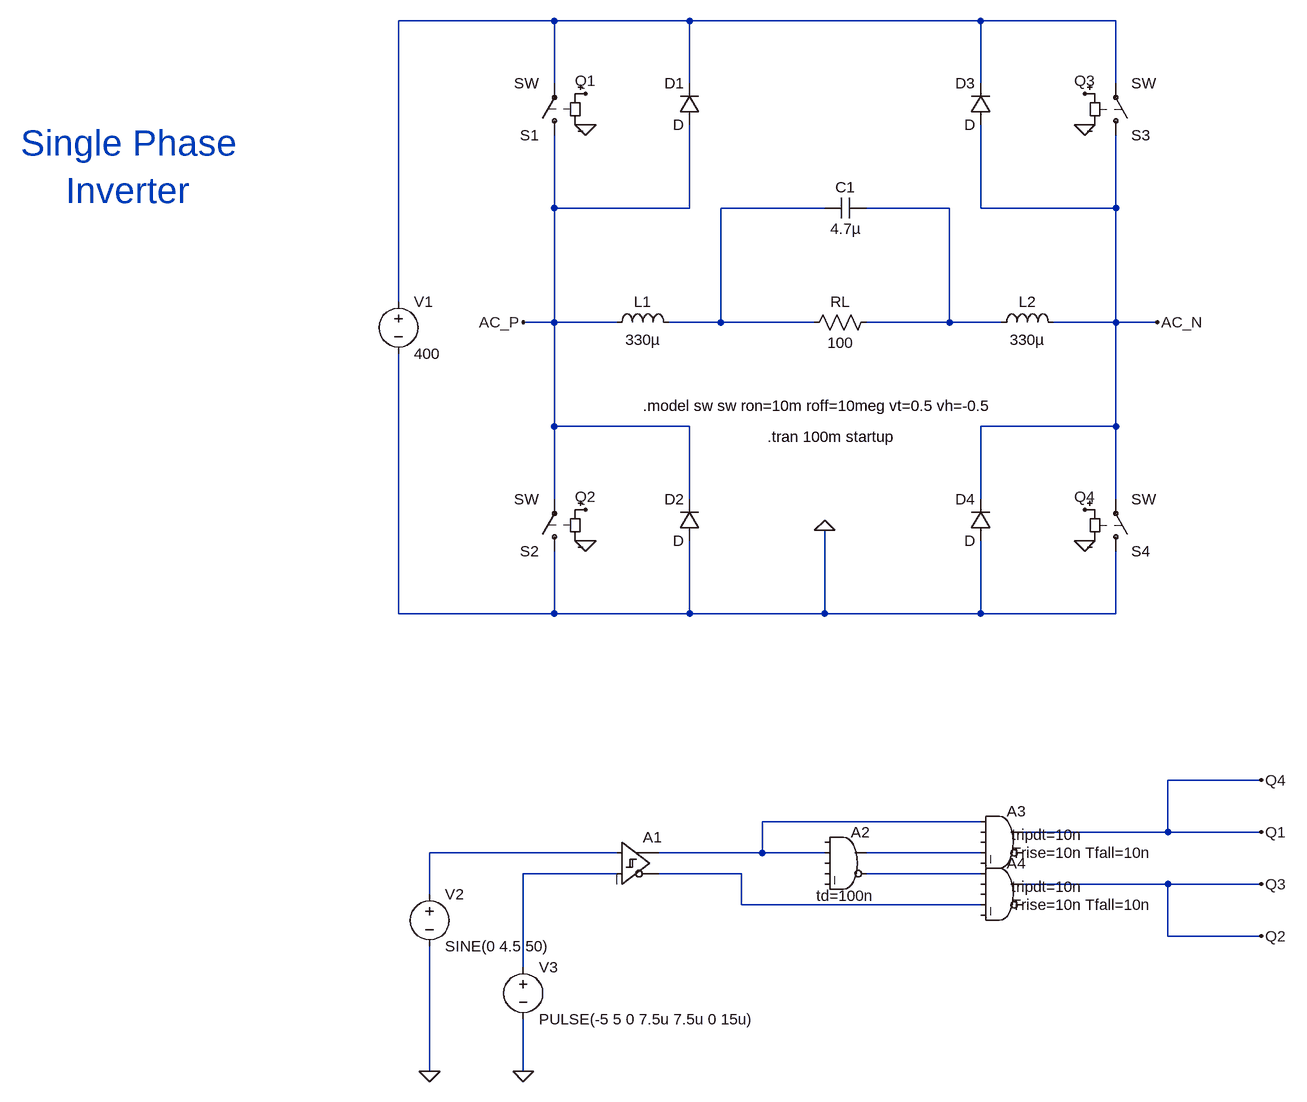
[diagram p0: schematic Ideal_Switches.asc]
Ideal_Switches.asc, the LTspice schematic file:
Version 4.1
SHEET 1 1104 1268
WIRE -32 -368 -272 -368
WIRE 176 -368 -32 -368
WIRE 624 -368 176 -368
WIRE 832 -368 624 -368
WIRE -32 -272 -32 -368
WIRE 176 -272 176 -368
WIRE 624 -272 624 -368
WIRE 832 -272 832 -368
WIRE -32 -80 -32 -192
WIRE 176 -80 176 -208
WIRE 176 -80 -32 -80
WIRE 384 -80 224 -80
WIRE 576 -80 448 -80
WIRE 624 -80 624 -208
WIRE 832 -80 832 -192
WIRE 832 -80 624 -80
WIRE -272 64 -272 -368
WIRE -32 96 -32 -80
WIRE -32 96 -80 96
WIRE 64 96 -32 96
WIRE 224 96 224 -80
WIRE 224 96 144 96
WIRE 368 96 224 96
WIRE 576 96 576 -80
WIRE 576 96 448 96
WIRE 656 96 576 96
WIRE 832 96 832 -80
WIRE 832 96 736 96
WIRE 896 96 832 96
WIRE -32 256 -32 96
WIRE 176 256 -32 256
WIRE 832 256 832 96
WIRE 832 256 624 256
WIRE -32 368 -32 256
WIRE 176 368 176 256
WIRE 624 368 624 256
WIRE 832 368 832 256
WIRE -272 544 -272 144
WIRE -32 544 -32 448
WIRE -32 544 -272 544
WIRE 176 544 176 432
WIRE 176 544 -32 544
WIRE 384 544 384 416
WIRE 384 544 176 544
WIRE 624 544 624 432
WIRE 624 544 384 544
WIRE 832 544 832 448
WIRE 832 544 624 544
WIRE 1056 800 912 800
WIRE 624 864 288 864
WIRE 912 880 912 800
WIRE 912 880 688 880
WIRE 1056 880 912 880
WIRE 64 912 -224 912
WIRE 288 912 288 864
WIRE 288 912 128 912
WIRE 384 912 288 912
WIRE 624 912 448 912
WIRE 64 944 -80 944
WIRE 256 944 128 944
WIRE 624 944 448 944
WIRE 912 960 688 960
WIRE 1056 960 912 960
WIRE -224 976 -224 912
WIRE 256 992 256 944
WIRE 624 992 256 992
WIRE 912 1040 912 960
WIRE 1056 1040 912 1040
WIRE -80 1088 -80 944
WIRE -224 1248 -224 1056
WIRE -80 1248 -80 1168
FLAG 16 -208 0
FLAG 16 432 0
FLAG 784 432 0
FLAG 784 -208 0
FLAG -80 1248 0
FLAG -224 1248 0
FLAG 1056 880 Q1
FLAG 1056 800 Q4
FLAG 1056 960 Q3
FLAG 1056 1040 Q2
FLAG 16 -256 Q1
FLAG 16 384 Q2
FLAG 784 -256 Q3
FLAG 784 384 Q4
FLAG -80 96 AC_P
FLAG 896 96 AC_N
FLAG 384 416 0
SYMBOL voltage -272 48 R0
WINDOW 123 0 0 Left 0
WINDOW 39 0 0 Left 0
SYMATTR InstName V1
SYMATTR Value 400
SYMBOL sw -32 -176 R180
SYMATTR InstName S1
SYMBOL sw -32 464 R180
SYMATTR InstName S2
SYMBOL sw 832 464 M180
SYMATTR InstName S4
SYMBOL sw 832 -176 M180
SYMATTR InstName S3
SYMBOL diode 192 -208 R180
WINDOW 0 24 64 Left 2
WINDOW 3 24 0 Left 2
SYMATTR InstName D1
SYMBOL diode 640 -208 R180
WINDOW 0 24 64 Left 2
WINDOW 3 24 0 Left 2
SYMATTR InstName D3
SYMBOL diode 640 432 R180
WINDOW 0 24 64 Left 2
WINDOW 3 24 0 Left 2
SYMATTR InstName D4
SYMBOL diode 192 432 R180
WINDOW 0 24 64 Left 2
WINDOW 3 24 0 Left 2
SYMATTR InstName D2
SYMBOL res 464 80 R90
WINDOW 0 0 56 VBottom 2
WINDOW 3 32 56 VTop 2
SYMATTR InstName RL
SYMATTR Value 100
SYMBOL ind 48 112 R270
WINDOW 0 32 56 VTop 2
WINDOW 3 5 56 VBottom 2
SYMATTR InstName L1
SYMATTR Value 330µ
SYMATTR SpiceLine Rser=0.1
SYMBOL ind 640 112 R270
WINDOW 0 32 56 VTop 2
WINDOW 3 5 56 VBottom 2
SYMATTR InstName L2
SYMATTR Value 330µ
SYMATTR SpiceLine Rser=0.1
SYMBOL cap 448 -96 R90
WINDOW 0 0 32 VBottom 2
WINDOW 3 32 32 VTop 2
SYMATTR InstName C1
SYMATTR Value 4.7µ
SYMATTR SpiceLine Rser=0.1
SYMBOL voltage -224 960 R0
WINDOW 123 0 0 Left 0
WINDOW 39 0 0 Left 0
SYMATTR InstName V2
SYMATTR Value SINE(0 4.5 50)
SYMBOL voltage -80 1072 R0
WINDOW 123 0 0 Left 0
WINDOW 39 0 0 Left 0
SYMATTR InstName V3
SYMATTR Value PULSE(-5 5 0 7.5u 7.5u 0 15u)
SYMBOL Digital\\diffschmitt 64 864 R0
SYMATTR InstName A1
SYMBOL Digital\\and 416 864 R0
WINDOW 3 -45 114 Left 2
SYMATTR Value td=100n
SYMATTR InstName A2
SYMBOL Digital\\and 656 832 R0
WINDOW 3 16 52 Left 2
WINDOW 123 16 80 Left 2
SYMATTR Value tripdt=10n
SYMATTR Value2 Trise=10n Tfall=10n
SYMATTR InstName A3
SYMBOL Digital\\and 656 912 R0
WINDOW 3 16 52 Left 2
WINDOW 123 16 80 Left 2
SYMATTR Value tripdt=10n
SYMATTR Value2 Trise=10n Tfall=10n
SYMATTR InstName A4
TEXT 104 224 Left 2 !.model sw sw ron=10m roff=10meg vt=0.5 vh=-0.5
TEXT 296 272 Left 2 !.tran 100m startup
TEXT -688 -144 Center 5 ;Single Phase\nInverter

The netlist it stands for:
* Ideal_Switches.asc
V1 N001 0 400
S1 AC_P N001 Q4 0 SW
S2 0 AC_P Q2 0 SW
S4 0 AC_N Q4 0 SW
S3 AC_N N001 Q2 0 SW
D1 AC_P N001 D
D3 AC_N N001 D
D4 0 AC_N D
D2 0 AC_P D
RL N003 N002 100
L1 AC_P N002 330µ Rser=0.1
L2 N003 AC_N 330µ Rser=0.1
C1 N003 N002 4.7µ Rser=0.1
V2 N005 0 SINE(0 4.5 50)
V3 N007 0 PULSE(-5 5 0 7.5u 7.5u 0 15u)
A1 N005 N007 0 0 0 N008 N004 0 SCHMITT
A2 0 N004 0 0 0 N009 N006 0 AND td=100n
A3 N004 0 0 N006 0 0 Q4 0 AND tripdt=10n Trise=10n Tfall=10n
A4 N009 0 0 N008 0 0 Q2 0 AND tripdt=10n Trise=10n Tfall=10n
.model D D
.lib standard.dio
.model sw sw ron=10m roff=10meg vt=0.5 vh=-0.5
.tran 100m startup
* Single Phase
* Inverter
.backanno
.end